# Altium schematic sheet Controller.SchDoc
size A4; PageSetup: Record=PageOptions|CenterHorizontal=True|CenterVertical=True|PrintScale=1.00|XCorrection=1.00|YCorrection=1.00|PrintKind=0|BorderSize=5000000|LeftOffset=0|BottomOffset=0|Orientation=2|PaperLength=1000|PaperWidth=1000|Scale=100|PaperSource=7|PrintQuality=-4|MediaType=1|DitherType=10|PaperKind=A4|PrintScaleMode=1
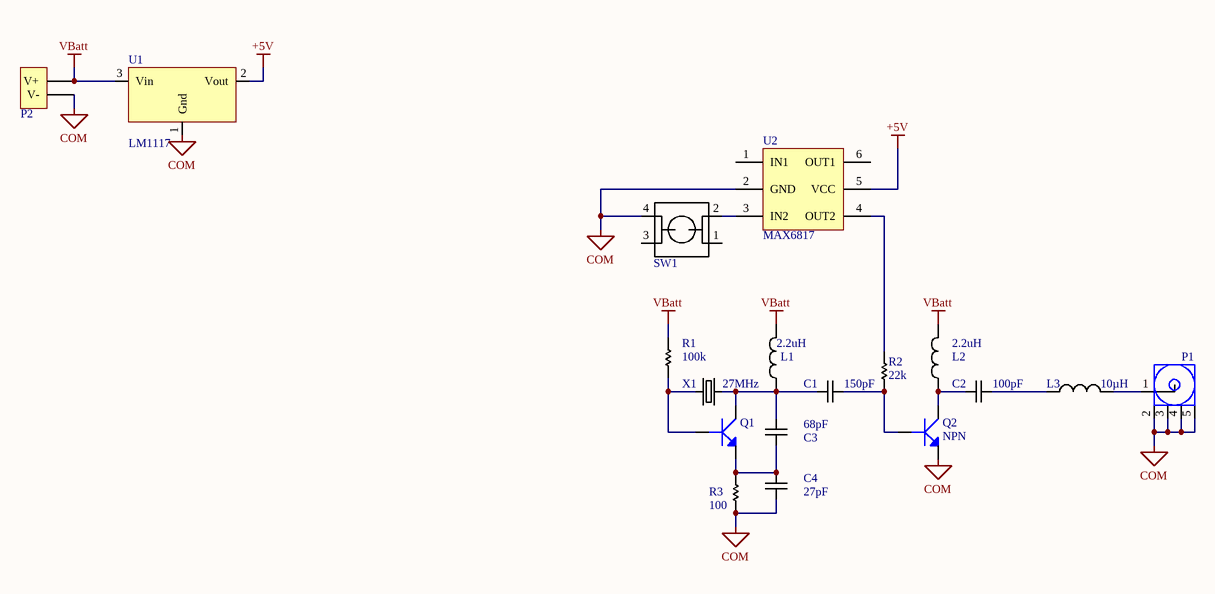
[diagram p0: Controller.SchDoc]

## Parts
C1  value 150pF  [0805 - Cap Non-Polarized]  (hidden comment: Cap)
C2  value 100pF  [0805 - Cap Non-Polarized]  (hidden comment: Cap)
C3  value 68pF  [0805 - Cap Non-Polarized]  (hidden comment: Cap)
C4  value 27pF  [0805 - Cap Non-Polarized]  (hidden comment: Cap)
L1  value 2.2uH  [1008 - INDUCTOR]  (hidden comment: Inductor)
L2  value 2.2uH  [1008 - INDUCTOR]  (hidden comment: Inductor)
L3  value 10µH  [1812 - Inductor]  (hidden comment: Inductor)
P1  Coax-F  [SMA-Female-R/A-THT]  (value not drawn)
P2  Battery Holder  [Battery Holder - 9V - THT]  (value not drawn)
Q1  NPN  [SOT23-3]  (value not drawn)
Q2  NPN  [SOT23-3]
R1  value 100k  [0805 - Resistor]  (hidden comment: Res)
R2  value 22k  [0805 - Resistor]  (hidden comment: Res)
R3  value 100  [0805 - Resistor]  (hidden comment: Res)
SW1  Tact Switch  [TE FSMJSMA]  (value not drawn)
U1  LM1117  [SOT223-3]
U2  MAX6817  [SOT23-6]
X1  value 27MHz  [HC49US]  (hidden comment: HC49US)

## Nets
+5V: U1.2(Vout) U2.5(VCC)
COM: C4.1 P1.2(GND) P1.3(GND) P1.4(GND) P1.5(GND) P2.2(V-) Q2.2(E) R3.1 SW1.4 U1.1(Gnd) U2.2(GND)
VBatt: L1.2 L2.2 P2.1(V+) R1.2 U1.3(Vin)
NetC1_1: C1.1 C3.2 L1.1 Q1.3(C) X1.2
NetC1_2: C1.2 Q2.1(B) R2.1
NetC2_1: C2.1 L2.1 Q2.3(C)
NetC2_2: C2.2 L3.1
NetC3_1: C3.1 C4.2 Q1.2(E) R3.2
NetL3_2: L3.2 P1.1(Signal)
NetQ1_1: Q1.1(B) R1.1 X1.1
NetR2_2: R2.2 U2.4(OUT2)
NetSW1_2: SW1.2 U2.3(IN2)

Not connected (* = marked no-connect by the designer): SW1 1 3; U2 1(IN1) 6(OUT1)

## Library data of the parts
C1 = Cap-TDK-CGA-150pF-0805: CAP CER 150PF 250V 5% NP0 0603; Manufacturer: TDK; Manufacturer No: CGA3E3C0G2E151J080AA; Sub Category: 0805; Part Number: Cap-TDK-CGA-150pF-0805; Category: Capacitor; Pin count: 2; Package: 0805; Series: CGA; Supplier 1: Digi-Key; Supplier Part Number 1: 445-5740-1-ND; ComponentLink1URL: http://product.tdk.com/capacitor/mlcc/en/documents/mlcc_automotive_midvoltage_en.pdf; ComponentLink1Description: Datasheet; Creation Date: 2013-09-25 17:50:57; Created by: Pier-Yves; Tolerance: ±5%; Height: 1.45mm; Voltage: 250V; Temperature: MLCC
C2 = Cap-TDK-CGA-100pF-0805: CAP CER 100PF 100V 5% NP0 0805; Manufacturer: TDK; Manufacturer No: CGA4C2C0G2A101J060AA; Sub Category: 0805; Part Number: Cap-TDK-CGA-100pF-0805; Category: Capacitor; Pin count: 2; Package: 0805; Series: CGA; Supplier 1: Digi-Key; Supplier Part Number 1: 445-6951-1-ND; ComponentLink1URL: http://product.tdk.com/capacitor/mlcc/en/documents/mlcc_automotive_midvoltage_en.pdf; ComponentLink1Description: Datasheet; Creation Date: 2013-09-19 19:23:33; Created by: Pier-Yves; Tolerance: 5%; Height: 1.45mm; Voltage: 100V; Temperature: MLCC
C3 = Cap-TDK-CGA-68pF-0805: CAP CER 68PF 100V 5% NP0 0603; Manufacturer: TDK; Manufacturer No: CGA3E2C0G2A680J080AA; Sub Category: 0805; Part Number: Cap-TDK-CGA-68pF-0805; Category: Capacitor; Pin count: 2; Package: 0805; Series: CGA; Supplier 1: Digi-Key; Supplier Part Number 1: 445-12337-1-ND; ComponentLink1URL: http://product.tdk.com/capacitor/mlcc/en/documents/mlcc_automotive_midvoltage_en.pdf; ComponentLink1Description: Datasheet; Creation Date: 2013-09-25 17:50:57; Created by: Pier-Yves; Tolerance: ±5%; Height: 1.45mm; Voltage: 100V; Temperature: MLCC
C4 = Cap-TDK-CGA-27pF-0805: CAP CER 27PF 50V 5% NP0 0603; Manufacturer: TDK; Manufacturer No: CGA3E2C0G1H270J080AA; Sub Category: 0805; Part Number: Cap-TDK-CGA-27pF-0805; Category: Capacitor; Pin count: 2; Package: 0805; Series: CGA; Supplier 1: Digi-Key; Supplier Part Number 1: 445-5633-1-ND; ComponentLink1URL: http://product.tdk.com/capacitor/mlcc/en/documents/mlcc_automotive_general_en.pdf; ComponentLink1Description: Datasheet; Creation Date: 2013-09-25 17:50:57; Created by: Pier-Yves; Tolerance: ±5%; Height: 1.45mm; Voltage: 50V; Temperature: MLCC
L1 L2 = Murata-LQW2UA-Ind-AirCore-2.2uH: IND 2200NH 280MA SRF 130MHZ 1008; Manufacturer: Murata Electronics North America; Manufacturer No: LQW2UAS2R2J00L; Sub Category: SMD; Tolerance: 5%; Part Number: Murata-LQW2UA-Ind-AirCore-2.2uH; Category: Inductor; Pin count: 2; Package: 2520; Series: LQW2UA; Supplier 1: Digi-Key; Supplier Part Number 1: 490-5710-1-ND; ComponentLink1URL: http://search.murata.co.jp/Ceramy/image/img/PDF/ENG/L0075S0080LQW2UA.pdf; ComponentLink1Description: Datasheet; Creation Date: 2013-09-12 02:00:35; Created by: Frederic; Height: 1.83mm; Current: 280mA; Temperature: -55°C ~ 125°C
L3 = Ind-Panasonic-FB-10µH-1812: INDUCTOR 10 UH 5% 1812 SMD; Manufacturer: Panasonic Electronic Components; Manufacturer No: ELJ-FB100JF; Sub Category: 1812; Current: 235mA; Part Number: Ind-Panasonic-FB-10µH-1812; Category: Inductor; Pin count: 2; Package: 1812; Series: FB; Supplier 1: Digi-Key; Supplier Part Number 1: PCD1453CT-ND; ComponentLink1URL: http://industrial.panasonic.com/www-cgi/jvcr13pz.cgi?E+PZ+3+AGA0031+ELJFB100JF+7+WW; ComponentLink1Description: Datasheet; Creation Date: 2013-09-26 18:57:04; Created by: Pier-Yves; Tolerance: ±5%; Height: 3.4mm; Temperature: -20°C ~ 85°C
P1 = coax-sma-ra-tht: CONN SMA JACK R/A 50 OHM PCB; Manufacturer: Linx Technologies Inc.; Manufacturer No: CONSMA002; Sub Category: Coaxial; Value: 12.4GHz; Part Number: coax-sma-ra-tht; Category: Connector; Pin count: 5; Supplier 1: Digi-Key; Supplier Part Number 1: CONSMA002-ND; ComponentLink1URL: http://www.linxtechnologies.com/resources/documents/sma_rp-sma_specs.pdf; ComponentLink1Description: Datasheet; Creation Date: 2013-09-29 21:15:14; Created by: Pier-Yves; Height: 13.9mm; Temperature: -65°C ~ 165°C
P2 = Battery Holder-9V-THT-Open: HOLDER BATTERY 9V PC MOUNT; Manufacturer: MPD; Manufacturer No: BC9VPC; Part Number: Battery Holder-9V-THT-Open; Category: Battery Holder; Pin count: 2; Supplier 1: Digi-Key; Supplier Part Number 1: BC9VPC-ND; ComponentLink1URL: http://www.memoryprotectiondevices.com/datasheets/BC9VPC-datasheet.pdf; ComponentLink1Description: Datasheet; Creation Date: 2013-10-01 13:40:00; Created by: Pier-Yves; Value: 9V; Height: 21.41mm; Voltage: 9V
Q1 Q2 = MMBT2222A-7-F: TRANS NPN 40V 350MW SMD SOT23-3; Manufacturer: Diodes Inc.; Sub Category: BJT NPN; Power: 300mW; Current: 600mA; Part Number: MMBT2222A-7-F; Category: Transistor; Pin count: 3; Package: SOT-23-3; Manufacturer No: MMBT2222A-7-F; Supplier 1: Digi-Key; Supplier Part Number 1: MMBT2222A-FDICT-ND; ComponentLink1URL: http://www.diodes.com/datasheets/ds30041.pdf; ComponentLink1Description: Datasheet; Creation Date: 2013-09-25 15:47:37; Created by: Pier-Yves
R1 = Yagao-RC0805-100k: RES 100K OHM 1/8W 5% 0805 SMD; Manufacturer: Yagao; Manufacturer No: RC0805JR-07100KL; Sub Category: 0805; Part Number: Yagao-RC0805-100k; Category: Resistor; Pin count: 2; Package: 0805; Series: RC0805; Supplier 1: Digi-Key; Supplier Part Number 1: 311-100KARCT-ND; ComponentLink1URL: http://media.digikey.com/pdf/Data%20Sheets/Yageo%20PDFs/RC0805%20Pb%20Free.pdf; ComponentLink1Description: Datasheet; Creation Date: 2013-06-28 03:21:03; Created by: Pier-Yves; Tolerance: 5%; Power: 1/8W; Height: 0.6mm
R2 = Yagao-RC0805-22k: RES 22K OHM 1/8W 5% 0805 SMD; Manufacturer: Yagao; Manufacturer No: RC0805JR-0722KL; Sub Category: 0805; Part Number: Yagao-RC0805-22k; Category: Resistor; Pin count: 2; Package: 0805; Series: RC0805; Supplier 1: Digi-Key; Supplier Part Number 1: 311-22KARCT-ND; ComponentLink1URL: http://media.digikey.com/pdf/Data%20Sheets/Yageo%20PDFs/RC0805%20Pb%20Free.pdf; ComponentLink1Description: Datasheet; Creation Date: 2013-06-28 03:21:03; Created by: Pier-Yves; Tolerance: 5%; Power: 1/8W; Height: 0.6mm
R3 = Yagao-RC0805-100: RES 100 OHM 1/8W 5% 0805 SMD; Manufacturer: Yagao; Manufacturer No: RC0805JR-07100RL; Sub Category: 0805; Part Number: Yagao-RC0805-100; Category: Resistor; Pin count: 2; Package: 0805; Series: RC0805; Supplier 1: Digi-Key; Supplier Part Number 1: 311-100ARCT-ND; ComponentLink1URL: http://media.digikey.com/pdf/Data%20Sheets/Yageo%20PDFs/RC0805%20Pb%20Free.pdf; ComponentLink1Description: Datasheet; Creation Date: 2013-06-28 03:21:03; Created by: Pier-Yves; Tolerance: 5%; Power: 1/8W; Height: 0.6mm
SW1 = TactSwitch-SMD-Vertical-GullWing-6x6: SWITCH TACTILE SPST-NO 0.05A 12V; Manufacturer: TE Connectivity; Manufacturer No: FSM4JSMATR; Current: 50mA; Part Number: TactSwitch-SMD-Vertical-GullWing-6x6; Category: Switch; Sub Category: Tactile; Pin count: 4; Series: FSMJSMA, Alcoswitch; Supplier 1: Digi-Key; Supplier Part Number 1: 450-1759-1-ND; ComponentLink1URL: http://media.digikey.com/pdf/Data%20Sheets/Tyco%20Electronics%20Alcoswitch%20PDFs/FSM%20Series.pdf; ComponentLink1Description: Datasheet; Creation Date: 2013-10-09 16:09:19; Created by: Pier-Yves; Height: 5mm; Temperature: -35°C ~ 85°C
U1 = LM1117 5v SOT223-3: Regulator LDO 5V; Manufacturer: Texas Instrument; Manufacturer No: LM1117IMPX-5.0/NOPB; Sub Category: Linear Regulator; Voltage: 6.2V - 15V; Current: 800mA; Part Number: LM1117 5v SOT223-3; Category: IC; Pin count: 3; Package: SOT223-3; Supplier 1: Digi-Key; Supplier Part Number 1: LM1117IMPX-5.0/NOPBCT-ND; ComponentLink1URL: http://www.ti.com/lit/ds/symlink/lm1117-n.pdf; ComponentLink1Description: Datasheet; Creation Date: 2013-04-24 11:22:31; Created by: Pier-Yves; Value: 5V; Temperature: -40°C ~ 125°C
U2 = MAX6817: IC DEBOUNCER SWITCH DUAL SOT23-6; Manufacturer: Maxim Integrated; Manufacturer No: MAX6817EUT+T; Value: 2 Channels; Part Number: MAX6817; Category: IC; Sub Category: Debouncer; Pin count: 6; Package: SOT-23-6; Supplier 1: Digi-Key; Supplier Part Number 1: MAX6817EUT+TCT-ND; ComponentLink1URL: http://datasheets.maximintegrated.com/en/ds/MAX6816-MAX6818.pdf; ComponentLink1Description: Datasheet; Creation Date: 2013-10-01 12:52:13; Created by: Pier-Yves; Temperature: 2.7 V ~ 5.5 V
X1 = TXC-9C-27MHz: CRYSTAL 27MHZ 18PF SMD; Manufacturer: TXC CORPORATION; Manufacturer No: 9C-27.000MAAJ-T; Tolerance: 30ppm; Part Number: TXC-9C-27MHz; Category: Crystal; Sub Category: Crystal; Pin count: 2; Package: HC49US; Series: 9C; Supplier 1: Digi-Key; Supplier Part Number 1: 887-1070-1-ND; ComponentLink1URL: http://www.txccrystal.com/images/pdf/9c.pdf; ComponentLink1Description: Datasheet; Creation Date: 2013-09-06 04:23:09; Created by: Frederic; Height: 4.1mm; Temperature: -20°C ~ 70°C